# Altium schematic sheet SENSE ADC - 8CH.SchDoc
size B; Organization: Altium Limited; Address1: L3, 12a Rodborough Rd; Address2: Frenchs Forest; Address3: NSW; Address4: Australia 2086
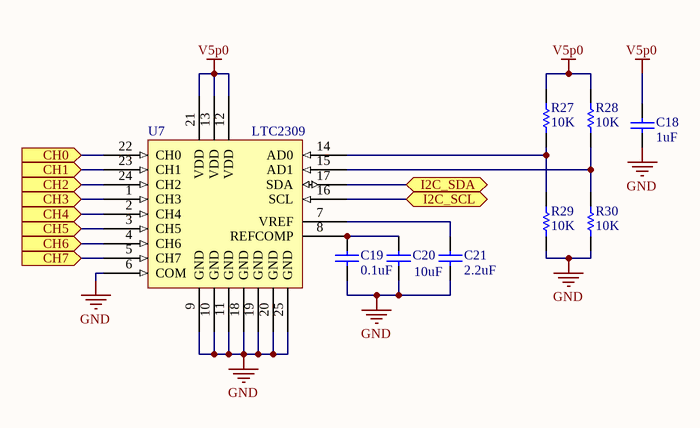
[diagram p0: SENSE ADC - 8CH.SchDoc]

## Parts
C18  value 1uF  [CAPC01005(0402)22_N]  (hidden comment: CAP, 0402, 1uF)
C19  value 0.1uF  [CAPC01005(0402)22_N]  (hidden comment: CAP, 0402, 0.1uF)
C20  value 10uF  [CAPC0805(2012)130_N]  (hidden comment: CAP, 0805, 10uF)
C21  value 2.2uF  [CAPC01005(0402)22_N]  (hidden comment: CAP, 0402, 2.2uF)
R27  10K  [RES, 0603]
R28  10K  [RES, 0603]
R29  10K  [RES, 0603]
R30  10K  [RES, 0603]
U7  LTC2309  [QFN50P400X400X80-24N]

## Ports
CH0 (in), CH1 (in), CH2 (in), CH3 (in), CH4 (in), CH5 (in), CH6 (in), CH7 (in), I2C_SCL (bidir), I2C_SDA (bidir)

## Nets
GND: C18.1 C19.1 C20.1 C21.1 R29.2 R30.2 U7.6(COM) U7.9(GND) U7.10(GND) U7.11(GND) U7.18(GND) U7.19(GND) U7.20(GND) U7.25(GND)
V5p0: C18.2 R27.1 R28.1 U7.12(VDD) U7.13(VDD) U7.21(VDD)
CH0: U7.22(CH0) ; port CH0
CH1: U7.23(CH1) ; port CH1
CH2: U7.24(CH2) ; port CH2
CH3: U7.1(CH3) ; port CH3
CH4: U7.2(CH4) ; port CH4
CH5: U7.3(CH5) ; port CH5
CH6: U7.4(CH6) ; port CH6
CH7: U7.5(CH7) ; port CH7
I2C_SCL: U7.16(SCL) ; port I2C_SCL
I2C_SDA: U7.17(SDA) ; port I2C_SDA
NetC19_2: C19.2 C20.2 U7.8(REFCOMP)
NetC21_2: C21.2 U7.7(VREF)
NetR27_2: R27.2 R29.1 U7.14(AD0)
NetR28_2: R28.2 R30.1 U7.15(AD1)

## Notes on the sheet
- Title
- Size:
- Date:
- B
- Number:
- Time:
- Revision:
- Sheet
- of
- File:

## Library data of the parts
C21 = CAP, 0402, 2.2uF: Manufacturer: Taiyo Yuden; Manufacturer Part Number: EMK105ABJ225MV-F; Capacitance: 2.2µF; Voltage - Rated: 16V; Tolerance: ±20%; Temperature Coefficient: X5R; Description: CAP CER 2.2UF 16V 20% X5R 0402; Supplier 1: Digi-Key; Supplier Part Number 1: 587-3245-1-ND; Packaging: Cut Tape (CT); Mounting Type: Surface Mount, MLCC; Operating Temperature: -55°C ~ 85°C; Applications: General Purpose; Ratings: -; Package / Case: 0402 (1005 Metric); Size / Dimension: 0.039" L x 0.020" W (1.00mm x 0.50mm); Height - Seated (Max): -; Thickness (Max): 0.022" (0.55mm); Lead Spacing: -; Features: -; Lead Style: -; ComponentLink1URL: http://www.yuden.co.jp/productdata/catalog/en/mlcc101_e.pdf; ComponentLink1Description: http://www.yuden.co.jp/productdata/catalog/en/mlcc101_e.pdf; Supplier 2: Digi-Key; Supplier Part Number 2: 587-3302-1-ND; RoHS: RoHS Compliant; Category: Capacitors; Stock 2: 46990; Pricing 2: 1=0.49, 10=0.371, 50=0.2162, 100=0.1729, 250=0.12352, 500=0.08398, 1000=0.06793, 5000=0.05311 (USD)
R27-R30 = RES_0603_10K: Resistor, 0603, 1/10W, 10K ohm; Manufacturer: Panasonic Electronic Components; Manufacturer Part Number: ERJ-3EKF1002V; Description: RES 10K OHM 1/10W 1% 0603 SMD; Tolerance: ±1%; Power (Watts): 0.1W, 1/10W; Temperature Coefficient: ±100ppm/°C; Supplier 1: Digi-Key; RoHS: RoHS Compliant; Category: Resistors; Stock 1: 4631019; Pricing 1: 1=0.1, 50=0.0138, 100=0.0105, 250=0.0078, 500=0.00576, 1000=0.00384 (USD); Packaging: Cut Tape (CT); Resistance (Ohms): 10k; Composition: Thick Film; Features: -; Package / Case: 0603 (1608 Metric); Supplier Device Package: 0603; Size / Dimension: 0.063" L x 0.031" W (1.60mm x 0.80mm); Height: 0.022" (0.55mm); Number of Terminations: 2; ComponentLink1URL: http://industrial.panasonic.com/www-cgi/jvcr13pz.cgi?E+PZ+3+AOA0002+ERJ3EKF1002V+7+WW; ComponentLink1Description: http://industrial.panasonic.com/www-cgi/jvcr13pz.cgi?E+PZ+3+AOA0002+ERJ3EKF1002V+7+WW; Supplier Part Number 1: P10.0KHCT-ND
U7 = LTC2309: 8-Channel, 12-Bit SAR ADC with I2C Interface; Manufacturer: Linear Technology; Manufacturer Part Number: LTC2309CUF#PBF; Number of Bits: 12; Sampling Rate (Per Second): 14k; Data Interface: I²C, Serial; Number of Converters: 1; Voltage Supply Source: Single Supply; Number of Inputs and Type: 8 Single-Ended, Unipolar; 8 Single-Ended, Bipolar; 4 Differential, Unipolar; 4 Differential, Bipolar; Description: IC ADC 12BIT SAR 24-QFN; Packaging: Tube; Operating Temperature: 0°C ~ 70°C; Mounting Type: Surface Mount; Package / Case: 24-WFQFN Exposed Pad; Supplier Device Package: 24-QFN Exposed Pad (4x4); ComponentLink1URL: http://www.linear.com/docs/25786; ComponentLink1Description: http://www.linear.com/docs/25786; Supplier 1: Digi-Key; Supplier Part Number 1: LTC2309CUF#PBF-ND; RoHS: RoHS Compliant; Category: Integrated Circuits (ICs); Stock 1: 532; Pricing 1: 1=6.31, 25=5.27, 100=4.34 (USD)
C18 = CAP, 0402, 1uF: Supplier 1: Digi-Key; Supplier Part Number 1: 587-3245-1-ND
C19 = CAP, 0402, 0.1uF: Supplier 1: Digi-Key; Supplier Part Number 1: 587-1456-2-ND
C20 = CAP, 0805, 10uF: Supplier 1: Digi-Key; Supplier Part Number 1: 587-2985-1-ND